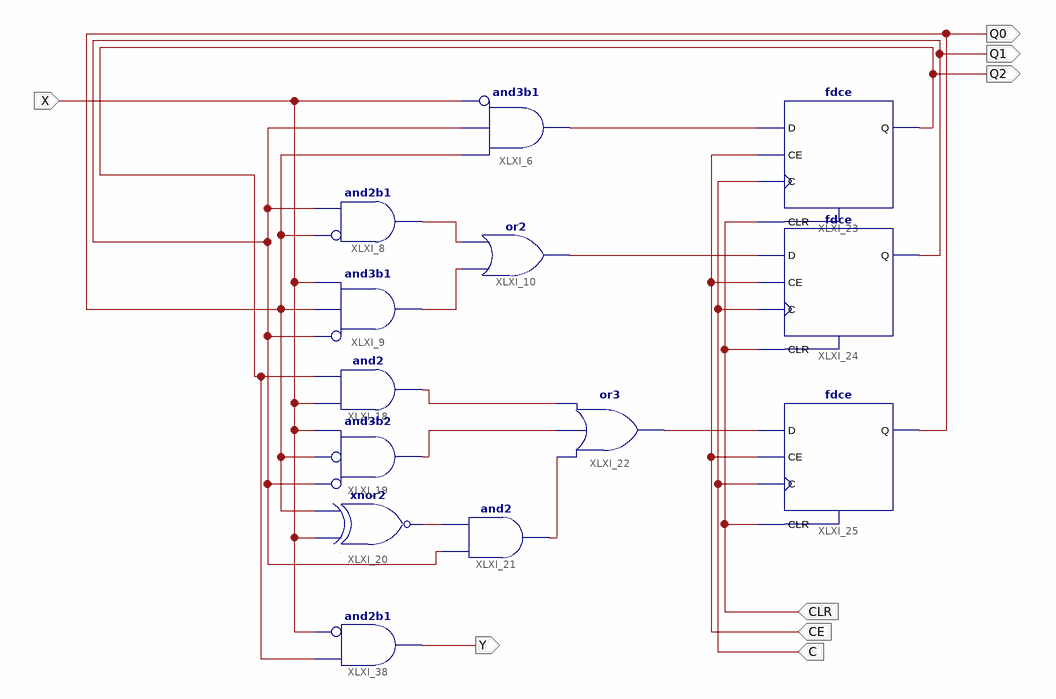
[diagram p0: schematic sheet 1]
// Xilinx ISE schematic lab4.sch (xc9500xl) as structural Verilog: 13 symbols, 8 ports
module lab4 (
  input  X,
  input  CLR,
  input  CE,
  input  C,
  output Q2,
  output Q0,
  output Q1,
  output Y
);

  wire XLXN_35, XLXN_36, XLXN_40, XLXN_42, XLXN_43, XLXN_44, XLXN_53, XLXN_54, XLXN_55;

  and XLXI_6 (XLXN_53, ~X, Q1, Q0);  // and3b1
  and XLXI_9 (XLXN_36, ~Q1, Q0, X);  // and3b1
  or XLXI_10 (XLXN_54, XLXN_36, XLXN_35);
  and XLXI_8 (XLXN_35, ~Q0, Q1);  // and2b1
  and XLXI_18 (XLXN_42, X, Q2);
  and XLXI_19 (XLXN_43, ~Q1, ~Q0, X);  // and3b2
  xnor XLXI_20 (XLXN_40, X, Q0);
  and XLXI_21 (XLXN_44, Q1, XLXN_40);
  or XLXI_22 (XLXN_55, XLXN_44, XLXN_43, XLXN_42);
  fdce XLXI_23 (.C(C), .CE(CE), .CLR(CLR), .D(XLXN_53), .Q(Q2));
  fdce XLXI_24 (.C(C), .CE(CE), .CLR(CLR), .D(XLXN_54), .Q(Q1));
  fdce XLXI_25 (.C(C), .CE(CE), .CLR(CLR), .D(XLXN_55), .Q(Q0));
  and XLXI_38 (Y, ~X, Q2);  // and2b1
endmodule
